# EAGLE schematic score_anzeige_register (EAGLE 9.0.1)
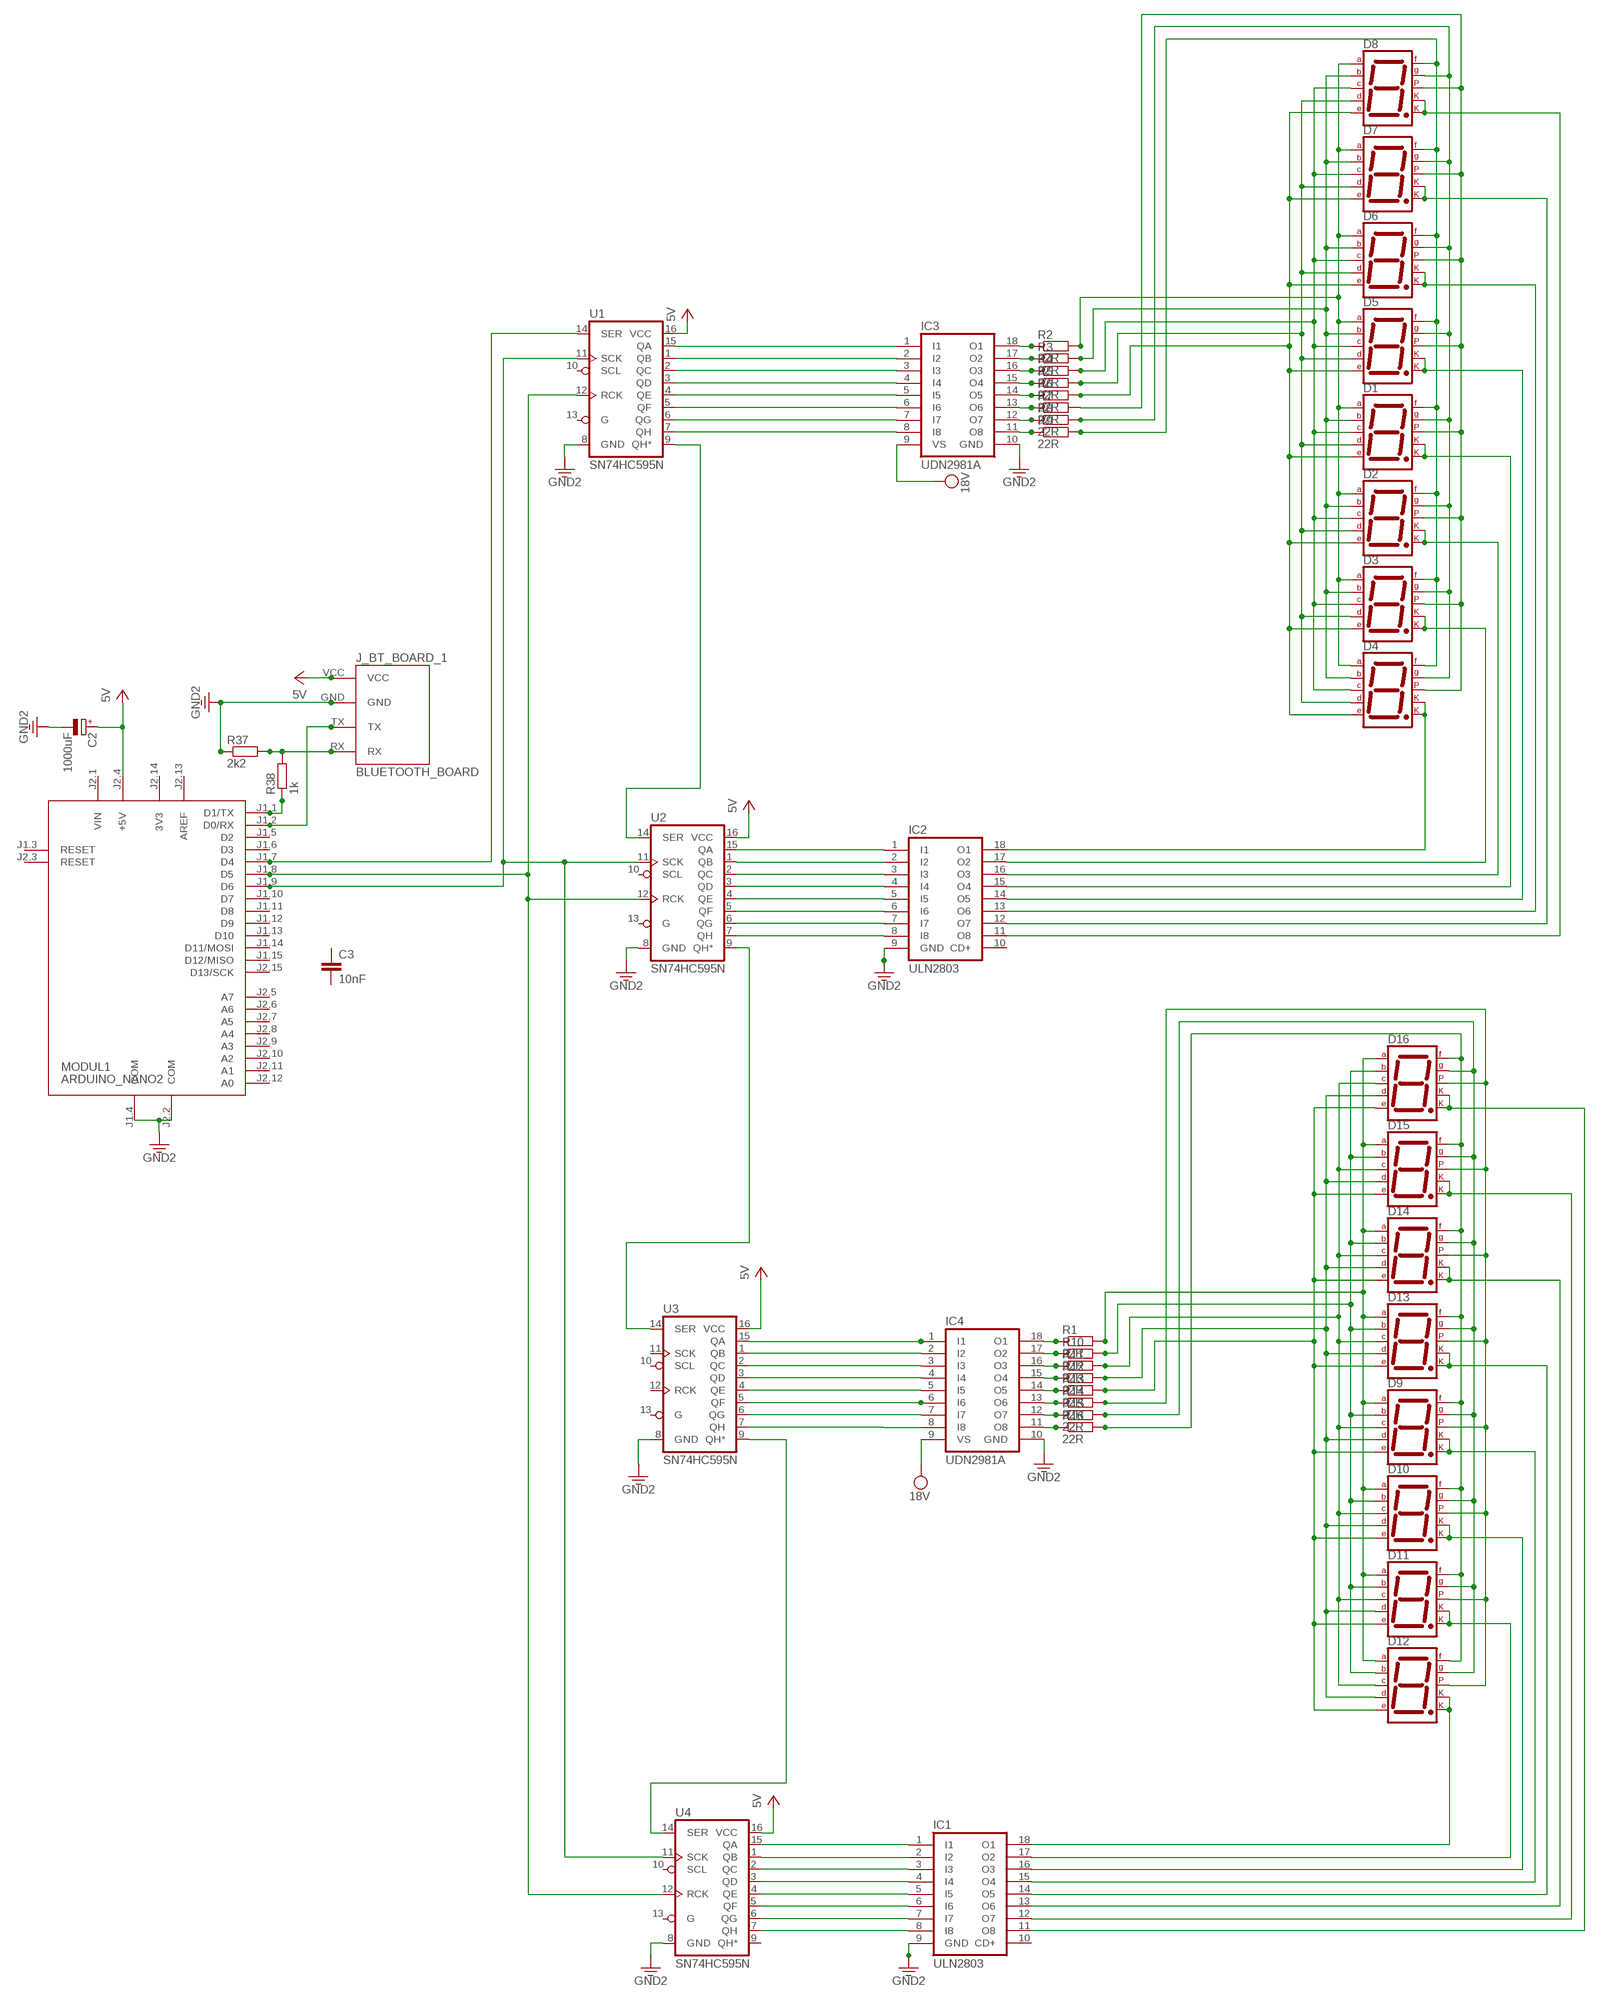
[diagram p0: schematic, sheet 1]

## Parts
C2  1000uF  CPOL-EUE5-10.5  [E5-10,5]
C3  10nF  C-EU025-025X050  [C025-025X050]
D1  7SEG-MCK  [7SEG-7]
D2  7SEG-MCK  [7SEG-7]
D3  7SEG-MCK  [7SEG-7]
D4  7SEG-MCK  [7SEG-7]
D5  7SEG-MCK  [7SEG-7]
D6  7SEG-MCK  [7SEG-7]
D7  7SEG-MCK  [7SEG-7]
D8  7SEG-MCK  [7SEG-7]
D9  7SEG-MCK  [7SEG-7]
D10  7SEG-MCK  [7SEG-7]
D11  7SEG-MCK  [7SEG-7]
D12  7SEG-MCK  [7SEG-7]
D13  7SEG-MCK  [7SEG-7]
D14  7SEG-MCK  [7SEG-7]
D15  7SEG-MCK  [7SEG-7]
D16  7SEG-MCK  [7SEG-7]
IC1  ULN2803  ULN2803A  [DIL18]
IC2  ULN2803  ULN2803A  [DIL18]
IC3  UDN2981A  [DIL18]
IC4  UDN2981A  [DIL18]
J_BT_BOARD_1  BLUETOOTH_BOARD  [BT_BOARD_FOOTPRINT]
MODUL1  ARDUINO_NANO2  [ARDUINO_NANO2]
R1  22R  R-EU_0204/7  [0204/7]
R2  22R  R-EU_0204/7  [0204/7]
R3  22R  R-EU_0204/7  [0204/7]
R4  22R  R-EU_0204/7  [0204/7]
R5  22R  R-EU_0204/7  [0204/7]
R6  22R  R-EU_0204/7  [0204/7]
R7  22R  R-EU_0204/7  [0204/7]
R8  22R  R-EU_0204/7  [0204/7]
R9  22R  R-EU_0204/7  [0204/7]
R10  22R  R-EU_0204/7  [0204/7]
R11  22R  R-EU_0204/7  [0204/7]
R12  22R  R-EU_0204/7  [0204/7]
R13  22R  R-EU_0204/7  [0204/7]
R14  22R  R-EU_0204/7  [0204/7]
R15  22R  R-EU_0204/7  [0204/7]
R16  22R  R-EU_0204/7  [0204/7]
R37  2k2  R-EU_0204/7  [0204/7]
R38  1k  R-EU_0204/7  [0204/7]
U1  SN74HC595N  74HC595N  [DIP16]
U2  SN74HC595N  74HC595N  [DIP16]
U3  SN74HC595N  74HC595N  [DIP16]
U4  SN74HC595N  74HC595N  [DIP16]

## Nets
3.3V: C2.- IC1.9(GND) IC2.9(GND) IC3.10(GND) IC4.10(GND) J_BT_BOARD_1.GND MODUL1.J1.4(COM) MODUL1.J2.2(COM) R37.1 U1.8(GND) U2.8(GND) U3.8(GND) U4.8(GND) ; supply symbol labelled GND2
N$1: IC2.1(I1) U2.15(QA)
N$2: IC2.2(I2) U2.1(QB)
N$3: IC2.3(I3) U2.2(QC)
N$4: IC2.4(I4) U2.3(QD)
N$5: IC2.5(I5) U2.4(QE)
N$6: IC2.6(I6) U2.5(QF)
N$7: IC2.7(I7) U2.6(QG)
N$8: IC2.8(I8) U2.7(QH)
N$9: D4.1(CK1) D4.6(CK2) IC2.18(O1)
N$10: D3.1(CK1) D3.6(CK2) IC2.17(O2)
N$11: D2.1(CK1) D2.6(CK2) IC2.16(O3)
N$12: D1.1(CK1) D1.6(CK2) IC2.15(O4)
N$13: IC3.18(O1) R2.1
N$14: IC3.17(O2) R3.1
N$15: IC3.16(O3) R4.1
N$16: D5.1(CK1) D5.6(CK2) IC2.14(O5)
N$17: D6.1(CK1) D6.6(CK2) IC2.13(O6)
N$18: D7.1(CK1) D7.6(CK2) IC2.12(O7)
N$19: D8.1(CK1) D8.6(CK2) IC2.11(O8)
N$20: IC3.15(O4) R5.1
N$21: IC3.14(O5) R6.1
N$22: D1.10(A) D2.10(A) D3.10(A) D4.10(A) D5.10(A) D6.10(A) D7.10(A) D8.10(A) R2.2
N$23: IC3.13(O6) R7.1
N$24: IC3.12(O7) R8.1
N$25: IC3.11(O8) R9.1
N$26: D1.9(B) D2.9(B) D3.9(B) D4.9(B) D5.9(B) D6.9(B) D7.9(B) D8.9(B) R3.2
N$27: D1.8(C) D2.8(C) D3.8(C) D4.8(C) D5.8(C) D6.8(C) D7.8(C) D8.8(C) R4.2
N$28: D1.5(D) D2.5(D) D3.5(D) D4.5(D) D5.5(D) D6.5(D) D7.5(D) D8.5(D) R5.2
N$29: D1.4(E) D2.4(E) D3.4(E) D4.4(E) D5.4(E) D6.4(E) D7.4(E) D8.4(E) R6.2
N$30: D1.7(DP) D2.7(DP) D3.7(DP) D4.7(DP) D5.7(DP) D6.7(DP) D7.7(DP) D8.7(DP) R7.2
N$31: IC3.8(I8) U1.7(QH)
N$32: D1.2(F) D2.2(F) D3.2(F) D4.2(F) D5.2(F) D6.2(F) D7.2(F) D8.2(F) R9.2
N$33: D1.3(G) D2.3(G) D3.3(G) D4.3(G) D5.3(G) D6.3(G) D7.3(G) D8.3(G) R8.2
N$34: MODUL1.J1.7(D4) U1.14(SER)
N$35: IC4.8(I8) U3.7(QH)
N$36: MODUL1.J1.8(D5) U1.12(RCK) U2.12(RCK) U4.12(RCK)
N$37: U1.9(QH*) U2.14(SER)
N$38: MODUL1.J1.9(D6) U1.11(SCK) U2.11(SCK) U4.11(SCK)
N$39: D12.1(CK1) D12.6(CK2) IC1.18(O1)
N$40: D11.1(CK1) D11.6(CK2) IC1.17(O2)
N$41: IC3.1(I1) U1.15(QA)
N$42: IC3.2(I2) U1.1(QB)
N$43: IC3.3(I3) U1.2(QC)
N$44: IC3.4(I4) U1.3(QD)
N$45: IC3.5(I5) U1.4(QE)
N$46: IC4.6(I6) U3.5(QF)
N$47: IC3.7(I7) U1.6(QG)
N$48: IC3.6(I6) U1.5(QF)
N$49: MODUL1.J1.1(D1/TX) R38.1
N$50: D10.1(CK1) D10.6(CK2) IC1.16(O3)
N$51: D9.1(CK1) D9.6(CK2) IC1.15(O4)
N$52: D13.1(CK1) D13.6(CK2) IC1.14(O5)
N$53: D14.1(CK1) D14.6(CK2) IC1.13(O6)
N$54: D15.1(CK1) D15.6(CK2) IC1.12(O7)
N$55: D16.1(CK1) D16.6(CK2) IC1.11(O8)
N$56: D9.10(A) D10.10(A) D11.10(A) D12.10(A) D13.10(A) D14.10(A) D15.10(A) D16.10(A) R1.2
N$57: IC4.18(O1) R1.1
N$58: IC4.17(O2) R10.1
N$59: IC4.16(O3) R11.1
N$60: IC4.15(O4) R12.1
N$61: IC4.14(O5) R13.1
N$62: IC4.13(O6) R14.1
N$63: IC4.12(O7) R15.1
N$64: IC4.11(O8) R16.1
N$65: D9.9(B) D10.9(B) D11.9(B) D12.9(B) D13.9(B) D14.9(B) D15.9(B) D16.9(B) R10.2
N$66: D9.8(C) D10.8(C) D11.8(C) D12.8(C) D13.8(C) D14.8(C) D15.8(C) D16.8(C) R11.2
N$67: D9.5(D) D10.5(D) D11.5(D) D12.5(D) D13.5(D) D14.5(D) D15.5(D) D16.5(D) R12.2
N$68: D9.4(E) D10.4(E) D11.4(E) D12.4(E) D13.4(E) D14.4(E) D15.4(E) D16.4(E) R13.2
N$69: D9.2(F) D10.2(F) D11.2(F) D12.2(F) D13.2(F) D14.2(F) D15.2(F) D16.2(F) R16.2
N$70: D9.3(G) D10.3(G) D11.3(G) D12.3(G) D13.3(G) D14.3(G) D15.3(G) D16.3(G) R15.2
N$71: D9.7(DP) D10.7(DP) D11.7(DP) D12.7(DP) D13.7(DP) D14.7(DP) D15.7(DP) D16.7(DP) R14.2
N$72: IC4.1(I1) U3.15(QA)
N$73: IC4.2(I2) U3.1(QB)
N$74: IC4.3(I3) U3.2(QC)
N$75: IC4.4(I4) U3.3(QD)
N$76: IC4.5(I5) U3.4(QE)
N$78: IC4.7(I7) U3.6(QG)
N$83: IC1.1(I1) U4.15(QA)
N$84: IC1.2(I2) U4.1(QB)
N$85: IC1.3(I3) U4.2(QC)
N$86: IC1.4(I4) U4.3(QD)
N$87: IC1.5(I5) U4.4(QE)
N$88: IC1.6(I6) U4.5(QF)
N$89: IC1.7(I7) U4.6(QG)
N$90: IC1.8(I8) U4.7(QH)
N$91: U3.9(QH*) U4.14(SER)
N$92: U2.9(QH*) U3.14(SER)
N$104: J_BT_BOARD_1.TX MODUL1.J1.2(D0/RX)
N$105: J_BT_BOARD_1.RX R37.2 R38.2
VCC: C2.+ IC3.9(VS) IC4.9(VS) J_BT_BOARD_1.VCC MODUL1.J2.4(+5V) U1.16(VCC) U2.16(VCC) U3.16(VCC) U4.16(VCC) ; supply symbol labelled 5V, 18V
Unconnected: C3.1 C3.2 IC1.10(CD+) IC2.10(CD+) MODUL1.J1.3(RESET) MODUL1.J1.5(D2) MODUL1.J1.6(D3) MODUL1.J1.10(D7) MODUL1.J1.11(D8) MODUL1.J1.12(D9) MODUL1.J1.13(D10) MODUL1.J1.14(D11/MOSI) MODUL1.J1.15(D12/MISO) MODUL1.J2.3(RESET) MODUL1.J2.5(A7) MODUL1.J2.6(A6) MODUL1.J2.7(A5) MODUL1.J2.8(A4) MODUL1.J2.9(A3) MODUL1.J2.10(A2) MODUL1.J2.11(A1) MODUL1.J2.12(A0) MODUL1.J2.15(D13/SCK) U1.10(SCL) U1.13(G) U2.10(SCL) U2.13(G) U3.10(SCL) U3.11(SCK) U3.12(RCK) U3.13(G) U4.9(QH*) U4.10(SCL) U4.13(G)

## Power pins joined to a net without a drawn wire
3V3: MODUL1.J2.14(3V3)
AREF: MODUL1.J2.13(AREF)
VIN: MODUL1.J2.1(VIN)

## Library data of the parts
C2 = resistor:CPOL-EU: POLARIZED CAPACITOR, European symbol
C3 = resistor:C-EU: CAPACITOR, European symbol
D1-D16 = special:7SEG-MCK: 7-segment DISPLAY single cathode, 13 mm
IC1 IC2 = uln-udn:ULN2803A: DRIVER ARRAY
IC3 IC4 = uln-udn:UDN298*: DRIVER ARRAY Source: Allegro Microsystems Inc. / UDN2981-UDN2984.pdf
J_BT_BOARD_1 = Bluetooth HC-05:BLUETOOTH_BOARD: Bluetooth Board V1.05
MODUL1 = arduino:ARDUINO_NANO2: Arduino Nano2 Auto generated by modulcreator.ulp \;; ANZAHL: 2; MODUL: TRUE; STECKX0: -76200; STECKX1: 76200; STECKY0: 177800; STECKY1: 177800
R1-R16 R37 R38 = resistor:R-EU_: RESISTOR, European symbol
U1-U4 = SparkFun-IC-Logic:74*595: 8-Bit Shift Register (Serial to Parallel) Datasheet <http://cdn.sparkfun.com/datasheets/BreakoutBoards/MM74HC595.pdf> SparkFun Products SparkFun Shift Register Breakout - 74HC595 <https://www.sparkfun.com/products/10680> (BOB-10680); PROD_ID: IC-13123